# EAGLE schematic lighting_power (EAGLE 9.7.0)
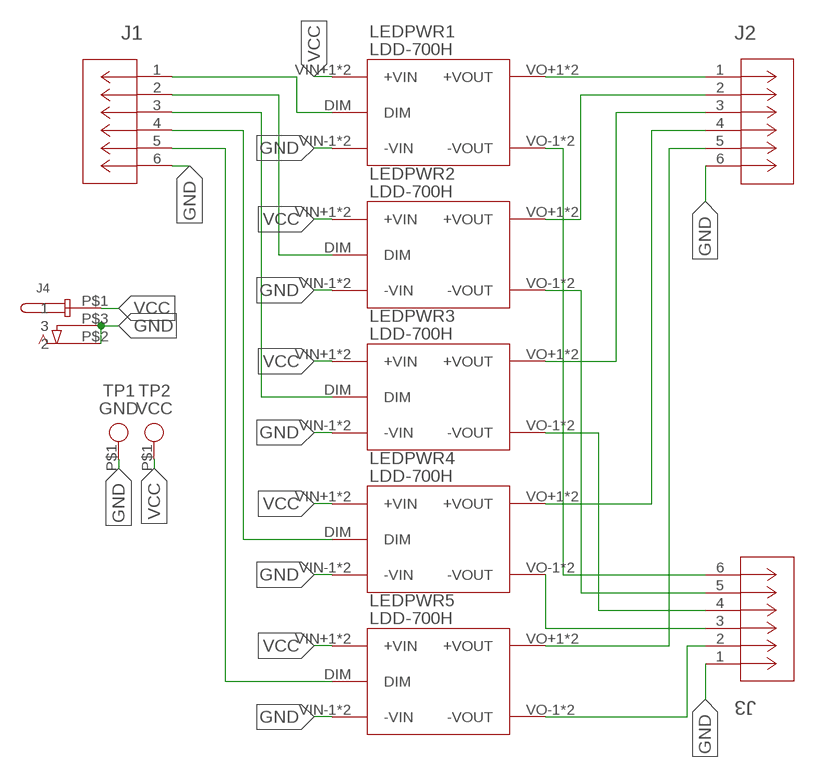
[diagram p0: schematic, sheet 1]

## Parts
J1  MOLEX-MICROLOCK-6PIN  [CON_5055670671]
J2  MOLEX-MICROLOCK-6PIN  [CON_5055670671]
J3  MOLEX-MICROLOCK-6PIN  [CON_5055670671]
J4  DCBARRELJACK  [DCBARRELJACK]
LEDPWR1  LDD-700H  NLDD-300~1000H  [NLDD-300~1000H]
LEDPWR2  LDD-700H  NLDD-300~1000H  [NLDD-300~1000H]
LEDPWR3  LDD-700H  NLDD-300~1000H  [NLDD-300~1000H]
LEDPWR4  LDD-700H  NLDD-300~1000H  [NLDD-300~1000H]
LEDPWR5  LDD-700H  NLDD-300~1000H  [NLDD-300~1000H]
TP1  GND  TP_CIRCLE_2.5MM  [TP_CIRCLE_2.5MM]
TP2  VCC  TP_CIRCLE_2.5MM  [TP_CIRCLE_2.5MM]

## Nets
GND: J1.6 J2.6 J3.1 J4.P$3 LEDPWR1.VIN-1(-VIN) LEDPWR1.VIN-2(-VIN) LEDPWR2.VIN-1(-VIN) LEDPWR2.VIN-2(-VIN) LEDPWR3.VIN-1(-VIN) LEDPWR3.VIN-2(-VIN) LEDPWR4.VIN-1(-VIN) LEDPWR4.VIN-2(-VIN) LEDPWR5.VIN-1(-VIN) LEDPWR5.VIN-2(-VIN) TP1.P$1
N$1: J1.1 LEDPWR1.DIM
N$2: J1.2 LEDPWR2.DIM
N$3: J1.3 LEDPWR3.DIM
N$4: J1.4 LEDPWR4.DIM
N$5: J1.5 LEDPWR5.DIM
N$6: J2.1 LEDPWR1.VO+1(+VOUT) LEDPWR1.VO+2(+VOUT)
N$7: J2.2 LEDPWR2.VO+1(+VOUT) LEDPWR2.VO+2(+VOUT)
N$8: J2.3 LEDPWR3.VO+1(+VOUT) LEDPWR3.VO+2(+VOUT)
N$9: J2.4 LEDPWR4.VO+1(+VOUT) LEDPWR4.VO+2(+VOUT)
N$10: J2.5 LEDPWR5.VO+1(+VOUT) LEDPWR5.VO+2(+VOUT)
N$11: J3.6 LEDPWR1.VO-1(-VOUT) LEDPWR1.VO-2(-VOUT)
N$12: J3.5 LEDPWR2.VO-1(-VOUT) LEDPWR2.VO-2(-VOUT)
N$13: J3.4 LEDPWR3.VO-1(-VOUT) LEDPWR3.VO-2(-VOUT)
N$14: J3.3 LEDPWR4.VO-1(-VOUT) LEDPWR4.VO-2(-VOUT)
N$15: J3.2 LEDPWR5.VO-1(-VOUT) LEDPWR5.VO-2(-VOUT)
N$16: J4.P$2
VCC: J4.P$1 LEDPWR1.VIN+1(+VIN) LEDPWR1.VIN+2(+VIN) LEDPWR2.VIN+1(+VIN) LEDPWR2.VIN+2(+VIN) LEDPWR3.VIN+1(+VIN) LEDPWR3.VIN+2(+VIN) LEDPWR4.VIN+1(+VIN) LEDPWR4.VIN+2(+VIN) LEDPWR5.VIN+1(+VIN) LEDPWR5.VIN+2(+VIN) TP2.P$1

## Library data of the parts
J1-J3 = Molex Micro-Lock PLUS 6-Pin 90deg:MOLEX-MICROLOCK-6PIN
J4 = DC Barrel Jack (Locking):DCBARRELJACK
LEDPWR1-LEDPWR5 = MeanWell NLDD-H Series:NLDD-300~1000H
TP1 TP2 = Test Point:TP_CIRCLE_2.5MM

## Net classes
0 default: width 0.254 mm, clearance 0.762 mm